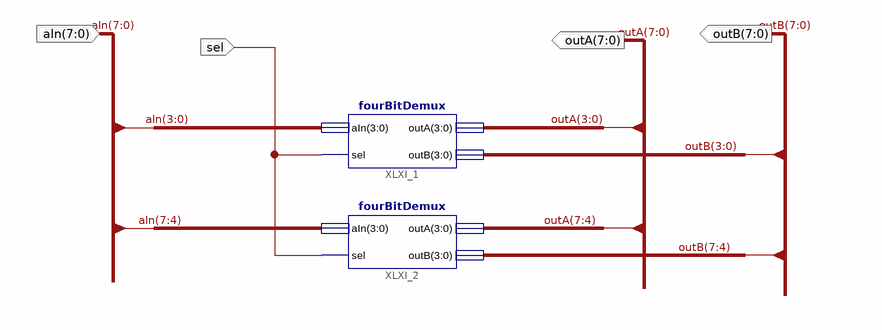
[diagram p0: schematic sheet 1]
// Xilinx ISE schematic eightBitDemux.sch (spartan3e) as structural Verilog: 2 symbols, 4 ports
module eightBitDemux (
  input  [7:0] aIn,
  input  sel,
  output [7:0] outA,
  output [7:0] outB
);

  fourBitDemux XLXI_1 (.aIn(aIn[3:0]), .sel(sel), .outA(outA[3:0]), .outB(outB[3:0]));
  fourBitDemux XLXI_2 (.aIn(aIn[7:4]), .sel(sel), .outA(outA[7:4]), .outB(outB[7:4]));
endmodule
